# EAGLE schematic EEG (EAGLE 9.4.2)
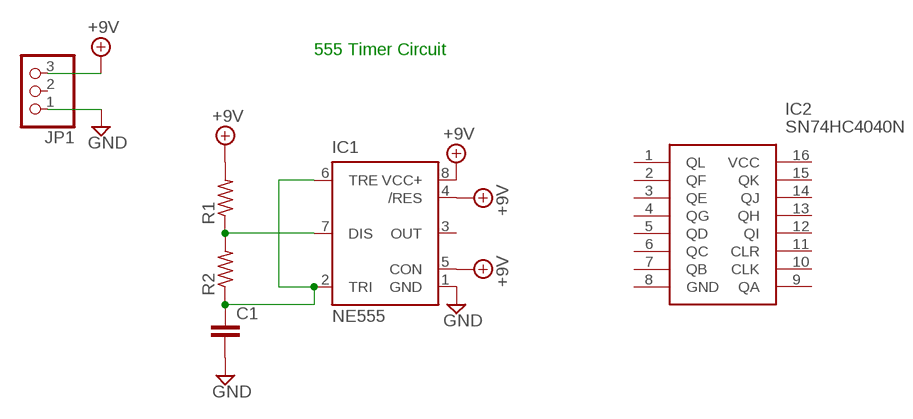
[diagram p0: schematic, sheet 1]

## Parts
C1  C-EU050-025X075  [C050-025X075]
IC1  NE555  [DIL-08]
IC2  SN74HC4040N  [DIP254P762X508-16]
JP1  PINHD-1X3  [1X03]
R1  R-US_0204/7  [0204/7]
R2  R-US_0204/7  [0204/7]

## Nets
+9V: IC1.4(/RES) IC1.5(CON) IC1.8(VCC+) JP1.3 R1.2
GND: C1.2 IC1.1(GND) JP1.1
N$1: C1.1 IC1.2(TRI) IC1.6(TRE) R2.1
N$2: IC1.7(DIS) R1.1 R2.2
Unconnected: IC1.3(OUT) IC2.1(QL) IC2.2(QF) IC2.3(QE) IC2.4(QG) IC2.5(QD) IC2.6(QC) IC2.7(QB) IC2.8(GND) IC2.9(QA) IC2.10(CLK) IC2.11(CLR) IC2.12(QI) IC2.13(QH) IC2.14(QJ) IC2.15(QK) IC2.16(VCC) JP1.2

## Notes on the sheet
- 555 Timer Circuit

## Library data of the parts
C1 = rcl:C-EU: CAPACITOR, European symbol; SPICEPREFIX: C
IC1 = st-microelectronics:NE555: General purpose bipolar Timer; MF: Arrow Electronics; MPN: NE555N; OC_FARNELL: 1467742; OC_NEWARK: 89K1486
IC2 = SN74HC4040N:SN74HC4040N: 12- Bit Asynchronous Binary counters Source: Datasheet <http://componentsearchengine.com/Datasheets/1/SN74HC4040N.pdf>; DESCRIPTION: 12- Bit Asynchronous Binary counters; HEIGHT: mm; MANUFACTURER_NAME: Texas Instruments; MANUFACTURER_PART_NUMBER: SN74HC4040N; MOUSER_PART_NUMBER: 595-SN74HC4040N; MOUSER_PRICE-STOCK: https://www.mouser.com/Search/Refine.aspx?Keyword=595-SN74HC4040N; RS_PART_NUMBER: 0443255; RS_PRICE-STOCK: http://uk.rs-online.com/web/p/products/0443255
JP1 = pinhead:PINHD-1X3: PIN HEADER
R1 R2 = rcl:R-US_: RESISTOR, American symbol; SPICEPREFIX: R